# Altium schematic sheet Motor driver.SchDoc
size A4
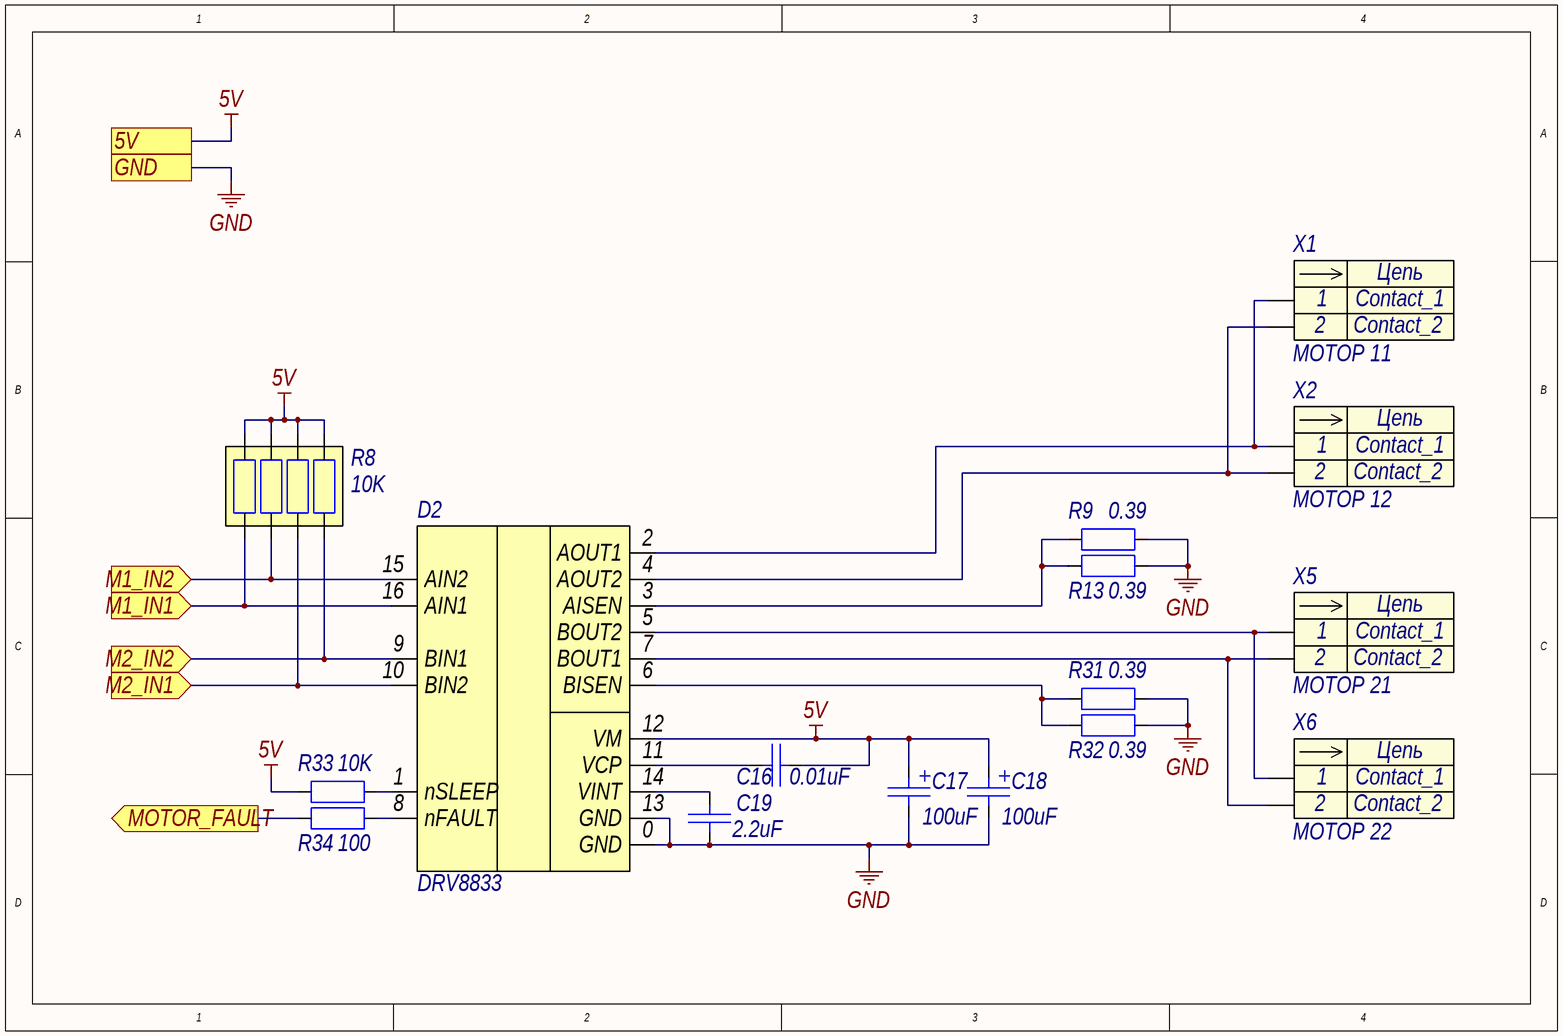
[diagram p0: Motor driver.SchDoc]

## Parts
C16  0.01uF  [NPC0805]
C17  100uF  [TANTAL CAPACITOR C]
C18  100uF  [TANTAL CAPACITOR C]
C19  2.2uF  [NPC0805]
D2  DRV8833  [TSSOP16]
R8  10K  [CAT16]
R9  0.39  [R2512]
R13  0.39  [R2512]
R31  0.39  [R2512]
R32  0.39  [R2512]
R33  10K  [R0805]
R34  100  [R0805]
X1  МОТОР 11  [KLS2-301-5.00 WITH LABEL]
X2  МОТОР 12  [KLS2-301-5.00 WITH LABEL]
X5  МОТОР 21  [KLS2-301-5.00 WITH LABEL]
X6  МОТОР 22  [KLS2-301-5.00 WITH LABEL]

## Ports
5V, GND, M1_IN1 (in), M1_IN2 (in), M2_IN1 (in), M2_IN2 (in), MOTOR_FAULT (out)

## Nets
5V: C16.1 C17.1 C18.1 D2.12(VM) R8.5 R8.6 R8.7 R8.8 R33.2 ; port 5V
GND: C17.2 C18.2 C19.1 D2.0(GND) D2.13(GND) R9.2 R13.2 R31.2 R32.2 ; port GND
M1_IN1: D2.16(AIN1) R8.1 ; port M1_IN1
M1_IN2: D2.15(AIN2) R8.2 ; port M1_IN2
M2_IN1: D2.10(BIN2) R8.3 ; port M2_IN1
M2_IN2: D2.9(BIN1) R8.4 ; port M2_IN2
MOTOR_FAULT: R34.2 ; port MOTOR_FAULT
NetC16_2: C16.2 D2.11(VCP)
NetC19_2: C19.2 D2.14(VINT)
NetD2_1: D2.1(nSLEEP) R33.1
NetD2_2: D2.2(AOUT1) X1.1 X2.1
NetD2_3: D2.3(AISEN) R9.1 R13.1
NetD2_4: D2.4(AOUT2) X1.2 X2.2
NetD2_5: D2.5(BOUT2) X5.1 X6.1
NetD2_6: D2.6(BISEN) R31.1 R32.1
NetD2_7: D2.7(BOUT1) X5.2 X6.2
NetD2_8: D2.8(nFAULT) R34.1

## Notes on the sheet
- (in symbol Header 2 pin) Цепь

## Library data of the parts
C16 C19 = Nonpolarized Capacitor: Nonpolarized Capacitor (Ceramic)
  C16: Value: 0.01uF
  C19: Value: 2.2uF
C17 C18 = Polarized Capacitor: Polarized Capacitor (Electrolytic, tantalum); Value: 100uF
D2 = DRV8833: DC motor driver, 2 channel,  2.7-10.8V, 1.5A
R8 = Resistor Array: Power rating: 0,05Вт; Value: 10K
R9 R13 R31-R34 = Resistor: Power rating: 2Вт
  R9 R13 R31 R32: Value: 0.39
  R33: Value: 10K
  R34: Value: 100
X1 X2 X5 X6 = Header 2 pin: Contact_1: Contact_1; Contact_2: Contact_2
  X1: Name: МОТОР 11
  X2: Name: МОТОР 12
  X5: Name: МОТОР 21
  X6: Name: МОТОР 22